# Altium schematic sheet 6_GPS.SchDoc
size A4; SheetNumber: 3; SheetTotal: 7
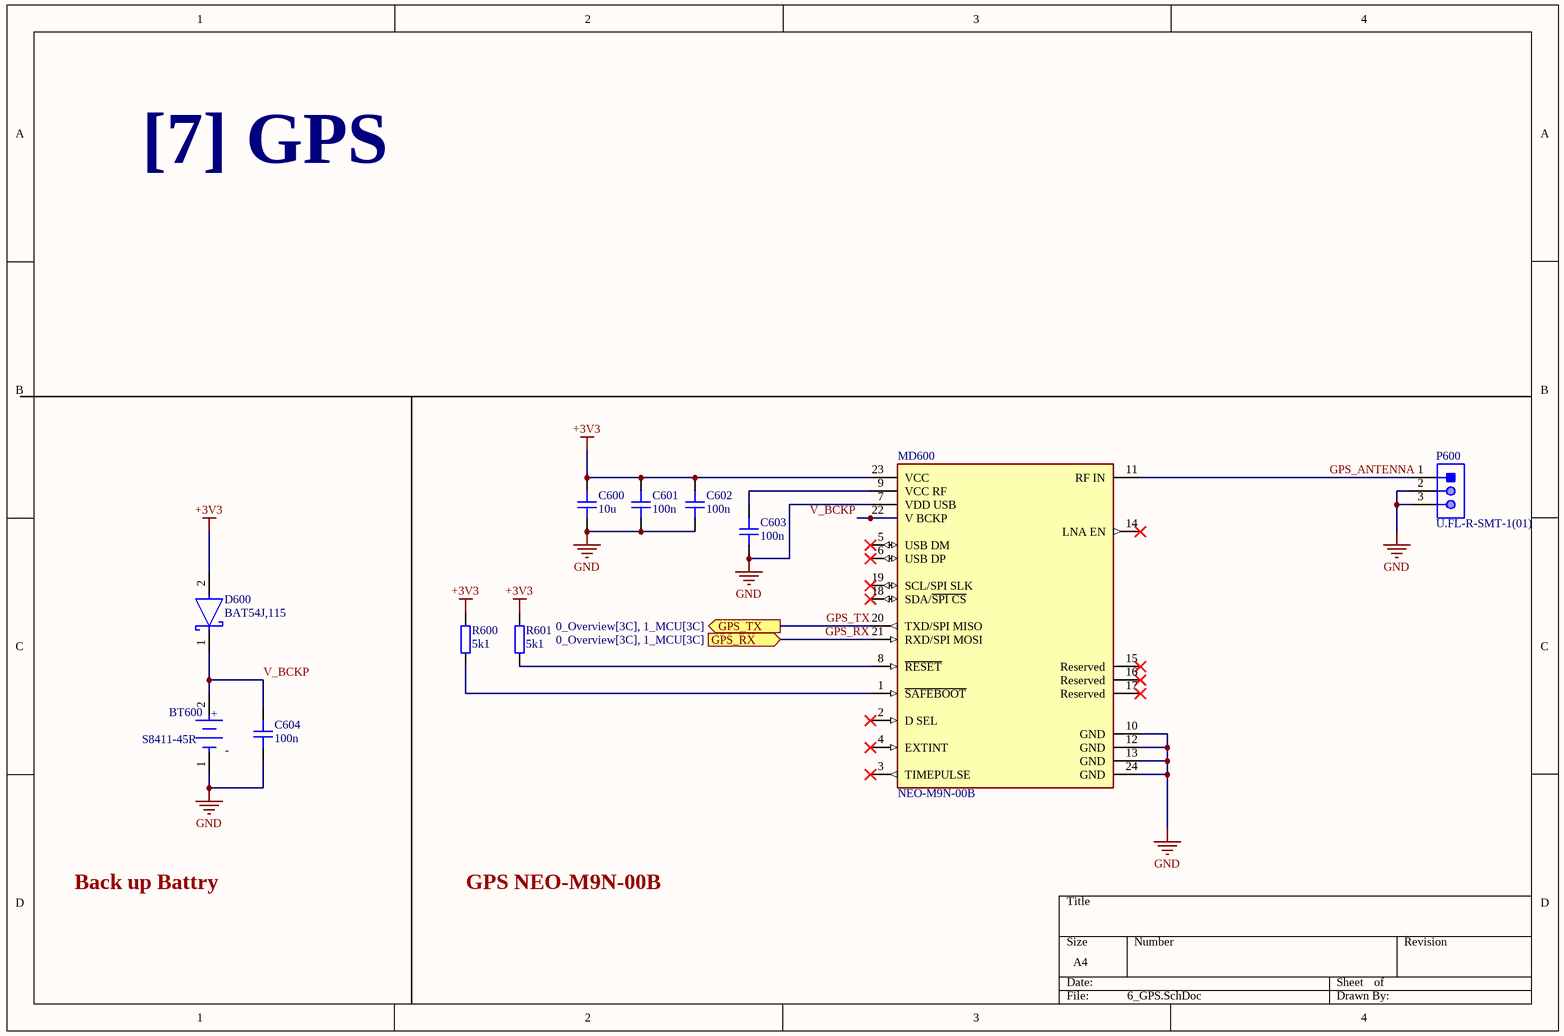
[diagram p0: 6_GPS.SchDoc]

## Parts
BT600  S8411-45R  [FP-S8411-45R-MFG]
C600  10u  [CAP_0805]
C601  100n  [CAP_0603]
C602  100n  [CAP_0603]
C603  100n  [CAP_0603]
C604  100n  [CAP_0603]
D600  BAT54J,115  [FP-SOD323F-MFG]
MD600  NEO-M9N-00B  [FP-NEO-M9N-00B-MFG]
P600  U.FL-R-SMT-1(01)  [HRS-U.FL-R-SMT-3_V]
R600  5k1  [RES_0603]
R601  5k1  [RES_0603]

## Ports
GPS_RX (in, see 0_Overview[3C], 1_MCU[3C]), GPS_TX (out, see 0_Overview[3C], 1_MCU[3C])

## Nets
+3V3: C600.2 C601.1 C602.1 D600.2(A) MD600.23(VCC) R600.2 R601.2
GND: BT600.1(C) C600.1 C601.2 C602.2 C603.2 C604.2 MD600.7(VDD_USB) MD600.10(GND) MD600.12(GND) MD600.13(GND) MD600.24(GND) P600.2 P600.3
GPS_ANTENNA: MD600.11(RF_IN) P600.1
GPS_RX: MD600.21(RXD/SPI_MOSI) ; port GPS_RX
GPS_TX: MD600.20(TXD/SPI_MISO) ; port GPS_TX
V_BCKP: BT600.2(A) C604.1 D600.1(C) MD600.22(V_BCKP)
NetC603_1: C603.1 MD600.9(VCC_RF)
NetMD600_1: MD600.1(~{SAFEBOOT}) R600.1
NetMD600_8: MD600.8(~{RESET}) R601.1

Not connected (* = marked no-connect by the designer): MD600 2(D_SEL)* 3(TIMEPULSE)* 4(EXTINT)* 5(USB_DM)* 6(USB_DP)* 14(LNA_EN)* 15(Reserved)* 16(Reserved)* 17(Reserved)* 18(SDA/~{SPI_CS})* 19(SCL/SPI_SLK)*

## Notes on the sheet
- [7] GPS
- Back up Battry
- GPS NEO-M9N-00B
- (in symbol CMP-15817-000007-1) +; -

## Library data of the parts
BT600 = CMP-15817-000007-1: BATTERY HOLDER COIN 12MM SMD; Number of Batteries: 1; Material: Polyphenylene; Case/Package: SMD/SMT; Number of Cells: 1; Min Operating Temperature: -55°C; Termination: SMD/SMT; REACH SVHC: No SVHC; Contact Plating: Bronze; Package Quantity: 500; Max Operating Temperature: 105°C; Mount: Surface Mount; Packaging: Tape and Reel
C600 = CAP_0805: Capacitor SMD 0805; Manufacturer: *; Manufacturer Part Number: *; Distributor Link: *; LCSC: *; Rating: *; Dielectric: *
C601-C604 = CAP_0603: Capacitor SMD 0603; Manufacturer: *; Manufacturer Part Number: *; Distributor Link: *; LCSC: *; Rating: *; Dielectric: *
D600 = CMP-14398-000037-1: DIODE SCHOTTKY 30V 200MA SOD323F; RoHS Compliant: Yes
MD600 = CMP-207130-000006-2: M9 standard precision module; Manufacturer: u-blox; Min Supply Voltage: 1.65V; Sensitivity: -167dBm; Interface: I2C,SPI,UART,USB; Max Supply Voltage: 3.6V; Device Class L3: RF Receivers; Category: UNK; Temperature Range Low: -40°C; Temperature Range High: +85°C; ComponentLink2Description: Datasheet; Manufacturer Part Number: NEO-M9N-00B; ComponentLink2URL: https://www.u-blox.com/sites/default/files/NEO-M9N_DataSheet_%28UBX-19014285%29.pdf; Footprint Url: https://www.u-blox.com/sites/default/files/NEO-M9N_Integrationmanual_%28UBX-19014286%29.pdf; Height: 2.6mm; Automotive: No; RoHS: TRUE; Lead Free: Yes; Octopart: https://octopart.com/neo-m9n-00b-u-blox-107315722; Package: 0; Temperature: -40°C to +85°C; Device Class L1: Integrated Circuits (ICs); Device Class L2: RF Semiconductors and Devices
P600 = CMP-2000-05153-1: Ultra Small Coaxial Connector, 6 GHz, -40 to 90 degC, 3-Pin SMD, RoHS, Bulk; Manufacturer: Hirose Electric; Connector Style: U.FL; Impedance: 50Ohm; Dielectric Material: LiquidCrystalPolymer(LCP); Minimum Quantity: UltraMiniatureCoaxial; Online Catalog: U.FLSeries; Featured Product: HiroseU.FLSeries; Frequency - Max: 6GHz; Other Names: H122041 / U.FL-R-SMT-1(01)-ND; Contact Termination: Solder; Body Material: PhosphorBronze; Connector Type: Jack,MalePin; Body Finish: Silver; Center Contact Plating: Gold; Manufacturer URL: https://www.hirose.com; Family: CoaxialConnectors(RF); Fastening Type: Snap-On; Unit PriceUSD: U.FL; Series: U.FL; Package Reference: U.FL-R-SMT; Packaging: Bulk; Standard Package: 100; Mounting Type: SurfaceMount; Quantity Available: Bulk; Housing Color: Silver; Package Description: 3-Pin Surface Mount Device, Body 2.6 x 2.6 mm; Category: Connectors,Interconnects; Operating Temperature: -40degC~90degC; Center Contact Material: PhosphorBronze; Dynamic Catalog: U.FLSeries; Datasheet URL: https://datasheet.ciiva.com/26945/getdatasheetpartid-475239-26945414.pdf; Datasheet Version: Feb-09; Shield Termination: Solder
R600 R601 = RES_0603: Resistor SMD 0603; Manufacturer: *; Manufacturer Part Number: *; Distributor Link: *; LCSC: *